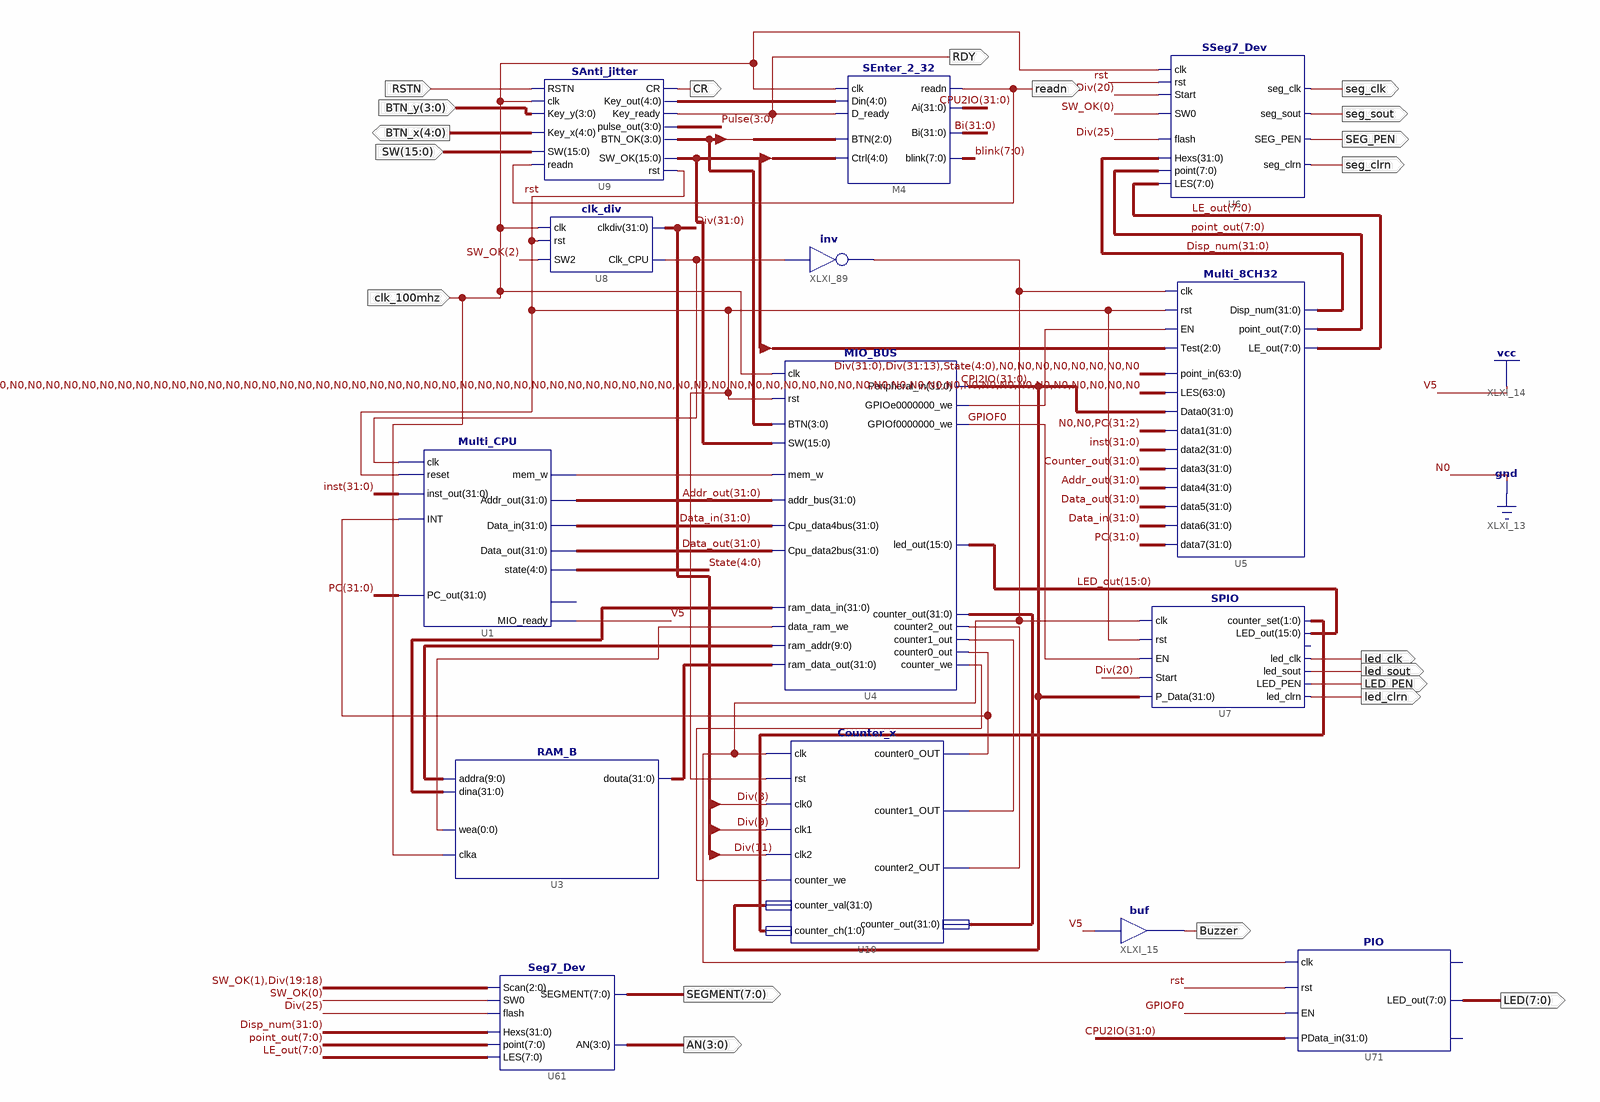
[diagram p0: schematic sheet 1]
// Xilinx ISE schematic top.sch (kintex7) as structural Verilog: 14 symbols, 20 ports
module top (
  input  RSTN,
  input  [3:0] BTN_y,
  input  [15:0] SW,
  input  clk_100mhz,
  output [4:0] BTN_x,
  output readn,
  output RDY,
  output CR,
  output seg_clk,
  output seg_sout,
  output SEG_PEN,
  output seg_clrn,
  output led_clk,
  output led_sout,
  output LED_PEN,
  output led_clrn,
  output [7:0] SEGMENT,
  output [3:0] AN,
  output [7:0] LED,
  output Buzzer
);

  wire Clk_CPU, GPIOF0, IO_clk, rst, XLXN_443, XLXN_469, XLXN_470, XLXN_472, XLXN_497, XLXN_524;
  wire [0:0] XLXN_527;
  wire [1:0] XLXN_491;
  wire [3:0] BTN_OK, Pulse;
  wire [4:0] State, XLXN_29;
  wire [7:0] blink, LE_out, point_out;
  wire [9:0] XLXN_526;
  wire [15:0] LED_out, SW_OK;
  wire [31:0] Addr_out, Bi, Counter_out, CPI2IO, CPU2IO, Data_in, Data_out, Disp_num, Div, inst, PC,
       XLXN_525, XLXN_529;

  Counter_x U10 (
    .clk(IO_clk), .rst(rst), .clk0(Div[8]), .clk1(Div[9]), .clk2(Div[11]), .counter_we(XLXN_472),
    .counter_val(CPI2IO), .counter_ch(XLXN_491), .counter0_OUT(XLXN_497), .counter1_OUT(XLXN_470),
    .counter2_OUT(XLXN_469), .counter_out(Counter_out));
  SAnti_jitter U9 (
    .SW(SW), .readn(readn), .Key_y(BTN_y), .Key_x(BTN_x), .RSTN(RSTN), .clk(clk_100mhz), .Key_out(XLXN_29),
    .Key_ready(RDY), .CR(CR), .rst(rst), .SW_OK(SW_OK), .pulse_out(Pulse), .BTN_OK(BTN_OK));
  clk_div U8 (.rst(rst), .clk(clk_100mhz), .SW2(SW_OK[2]), .clkdiv(Div), .Clk_CPU(Clk_CPU));
  SSeg7_Dev U6 (
    .LES(LE_out), .SEG_PEN(SEG_PEN), .seg_sout(seg_sout), .seg_clrn(seg_clrn), .point(point_out),
    .Hexs(Disp_num), .SW0(SW_OK[0]), .flash(Div[25]), .seg_clk(seg_clk), .clk(clk_100mhz), .rst(rst),
    .Start(Div[20]));
  SEnter_2_32 M4 (
    .readn(readn), .Ai(CPU2IO), .Bi(Bi), .blink(blink), .Din(XLXN_29), .D_ready(RDY), .clk(clk_100mhz),
    .Ctrl({SW_OK[7:5], SW_OK[15], SW_OK[0]}), .BTN(BTN_OK[2:0]));
  MIO_BUS U4 (
    .rst(rst), .clk(clk_100mhz), .mem_w(XLXN_524), .addr_bus(Addr_out), .Cpu_data4bus(Data_in),
    .Cpu_data2bus(Data_out), .ram_data_out(XLXN_525), .ram_addr(XLXN_526), .data_ram_we(XLXN_527[0]),
    .ram_data_in(XLXN_529), .counter_out(Counter_out), .counter2_out(XLXN_469), .counter1_out(XLXN_470),
    .counter0_out(XLXN_497), .counter_we(XLXN_472), .BTN(BTN_OK), .SW(SW_OK), .led_out(LED_out),
    .Peripheral_in(CPI2IO), .GPIOe0000000_we(XLXN_443), .GPIOf0000000_we(GPIOF0));
  SPIO U7 (
    .clk(IO_clk), .P_Data(CPI2IO), .rst(rst), .EN(GPIOF0), .Start(Div[20]), .led_clk(led_clk),
    .LED_out(LED_out), .counter_set(XLXN_491), .led_clrn(led_clrn), .LED_PEN(LED_PEN), .led_sout(led_sout));  // open: GPIOf0
  not XLXI_89 (IO_clk, Clk_CPU);
  Multi_8CH32 U5 (
    .Test(SW_OK[7:5]), .point_in({Div, Div[31:13], State, {8{1'b0}}}), .EN(XLXN_443), .clk(IO_clk),
    .rst(rst), .LES({64{1'b0}}), .Data0(CPI2IO), .data1({2'b00, PC[31:2]}), .data2(inst),
    .data3(Counter_out), .data4(Addr_out), .data5(Data_out), .data6(Data_in), .data7(PC),
    .point_out(point_out), .LE_out(LE_out), .Disp_num(Disp_num));
  Seg7_Dev U61 (
    .LES(LE_out), .Scan({SW_OK[1], Div[19:18]}), .SEGMENT(SEGMENT), .AN(AN), .point(point_out),
    .flash(Div[25]), .SW0(SW_OK[0]), .Hexs(Disp_num));
  buf XLXI_15 (Buzzer, 1'b1);
  PIO U71 (.clk(IO_clk), .rst(rst), .EN(GPIOF0), .PData_in(CPU2IO), .LED_out(LED));  // open: GPIOf0, counter_set
  Multi_CPU U1 (
    .clk(Clk_CPU), .reset(rst), .inst_out(inst), .INT(XLXN_497), .mem_w(XLXN_524), .state(State),
    .PC_out(PC), .Addr_out(Addr_out), .Data_out(Data_out), .Data_in(Data_in), .MIO_ready(1'b1));  // open: CPU_MIO
  RAM_B U3 (.addra(XLXN_526), .dina(XLXN_529), .wea(XLXN_527[0]), .clka(clk_100mhz), .douta(XLXN_525));
endmodule
